# EAGLE board mcat-4cu-b-v2f (EAGLE 6.5.0)
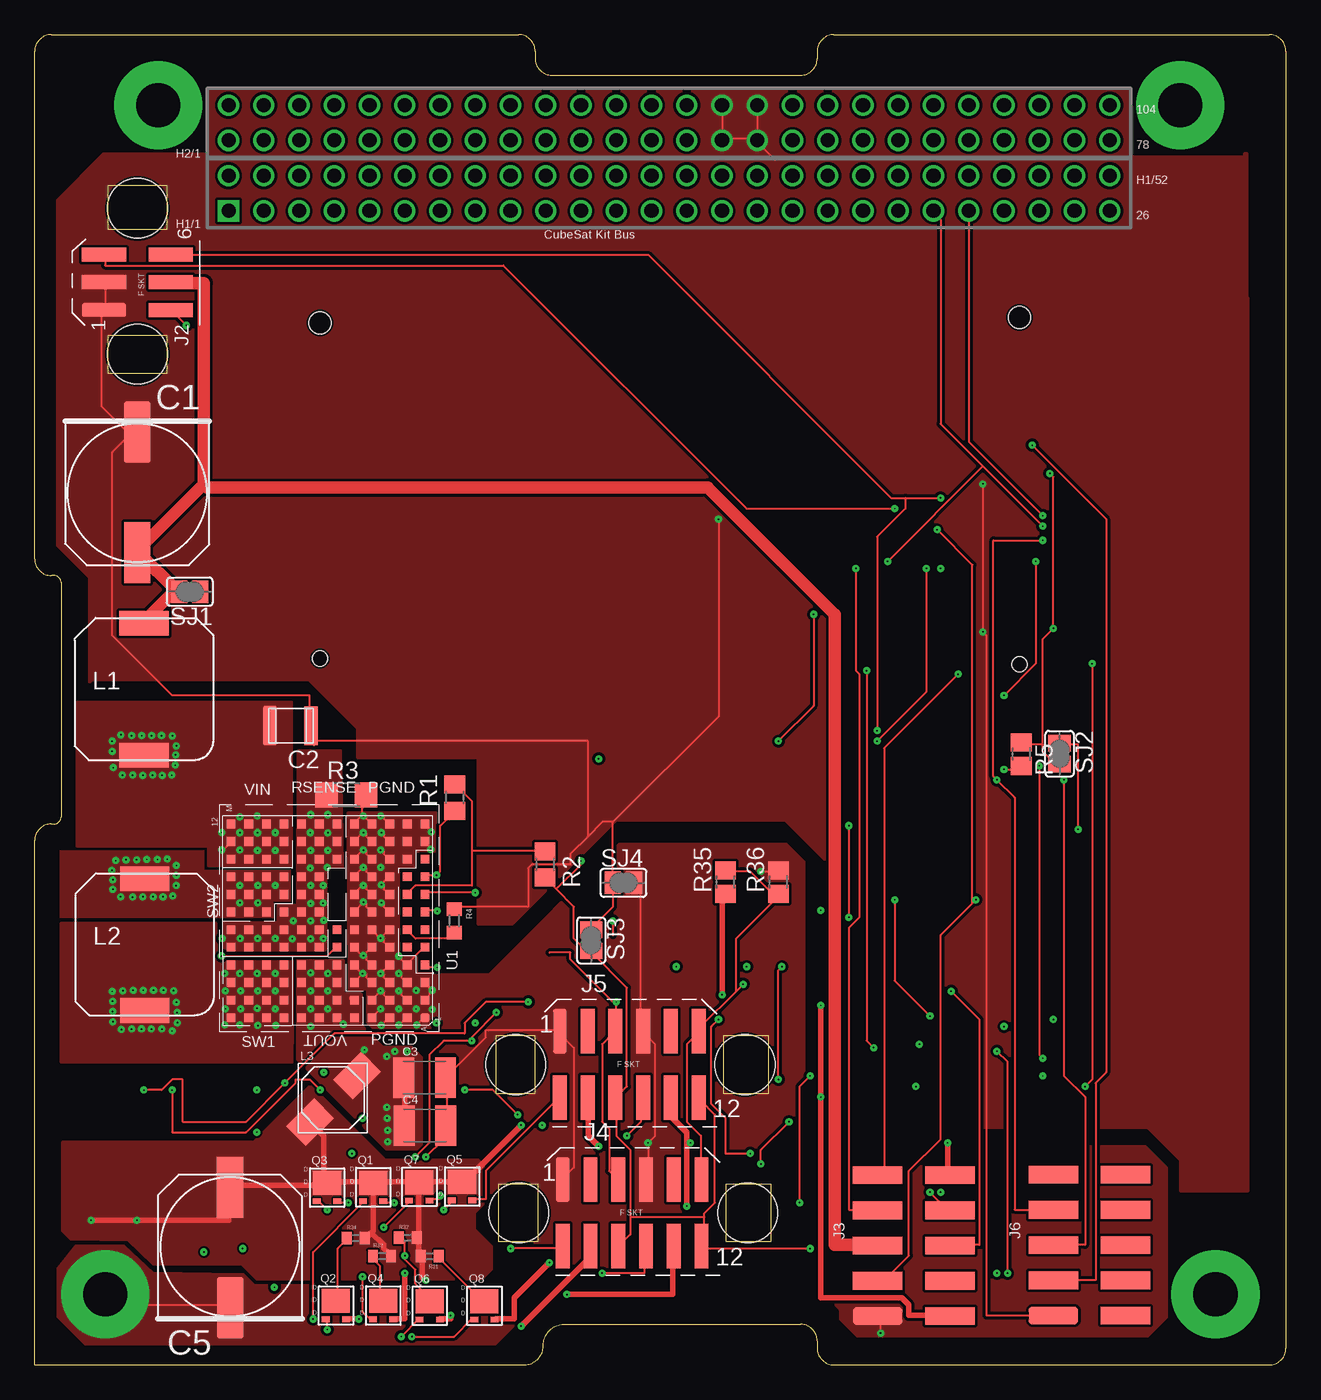
[diagram p5: board, top side]
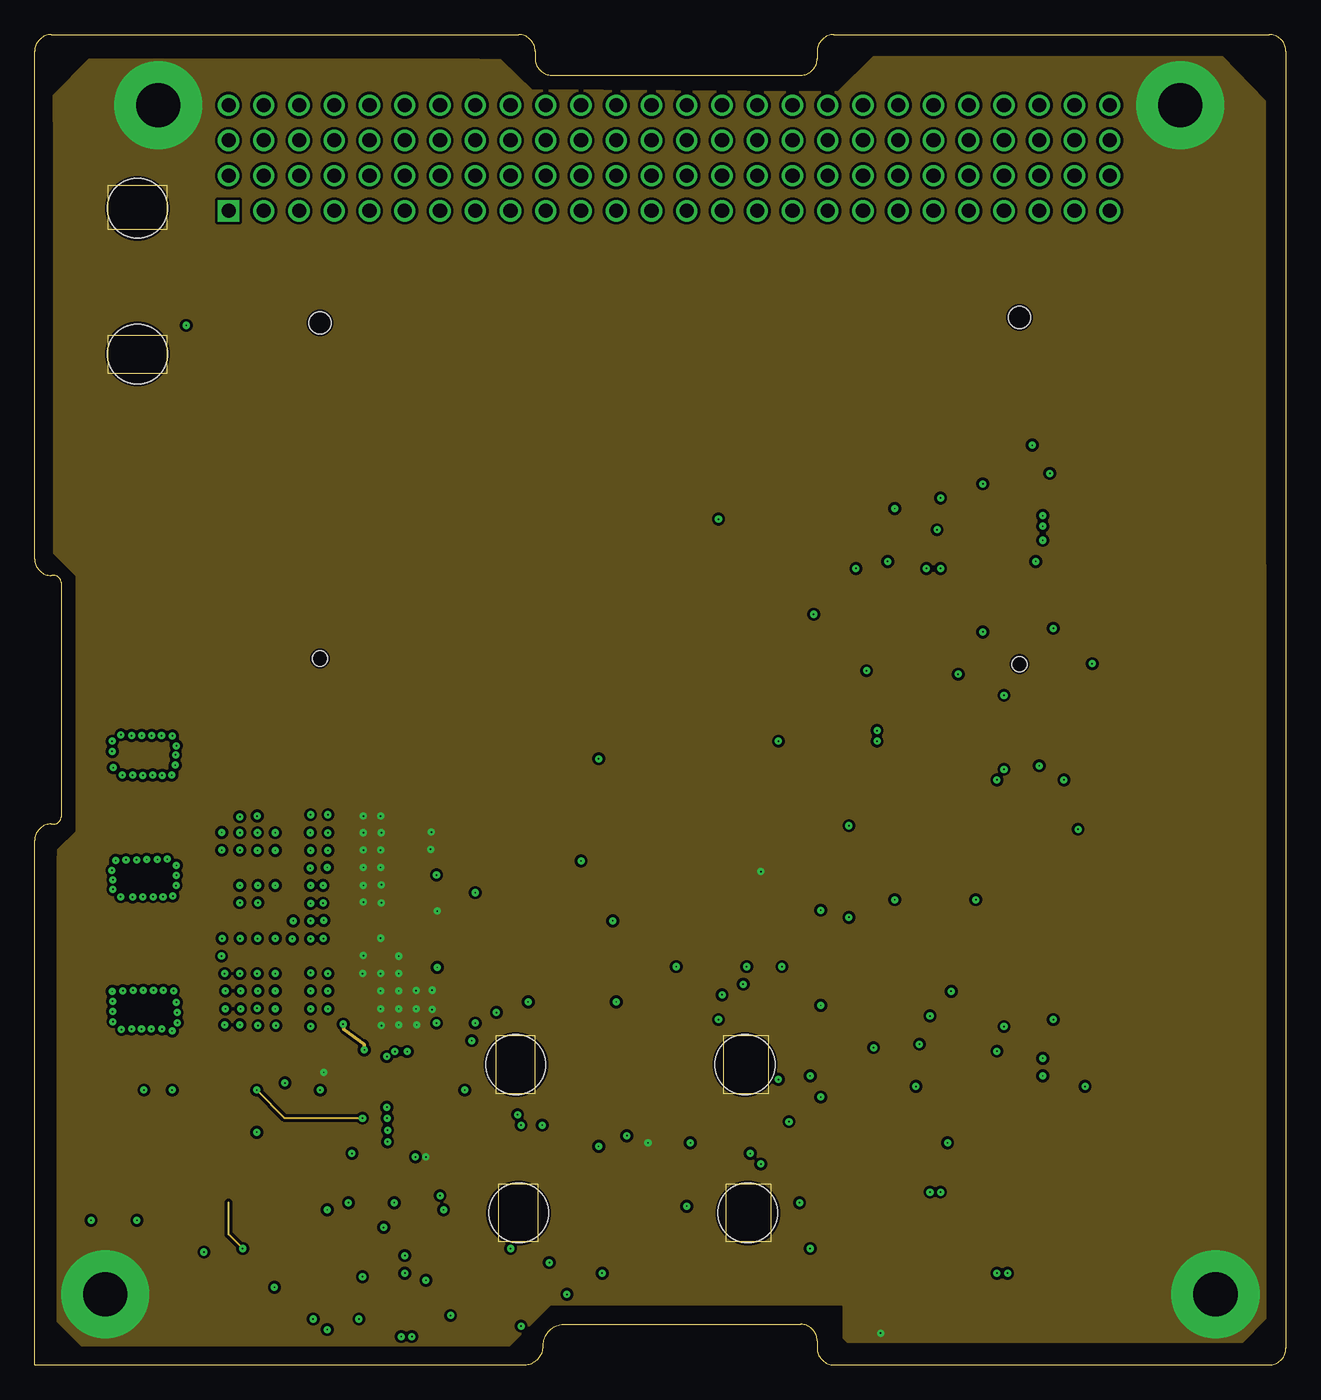
[diagram p6: board, inner layer GND_PLANE]
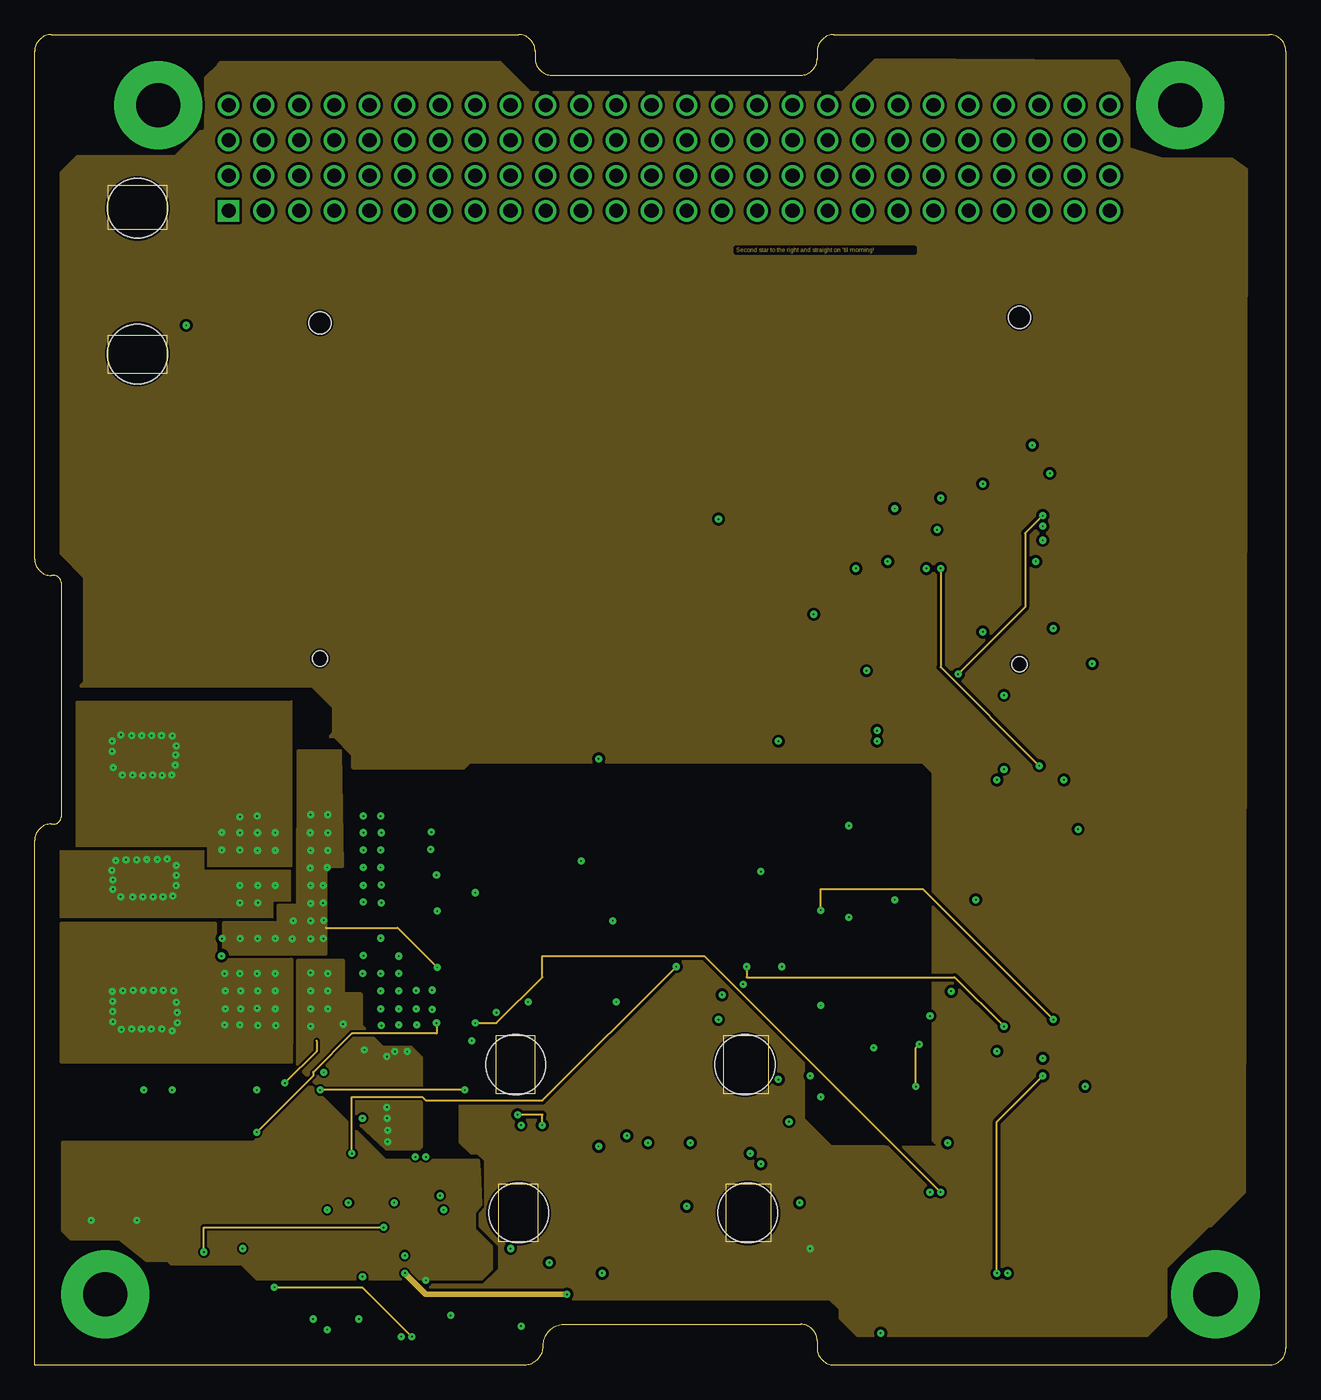
[diagram p7: board, inner layer GND_PLANE/TRACE]
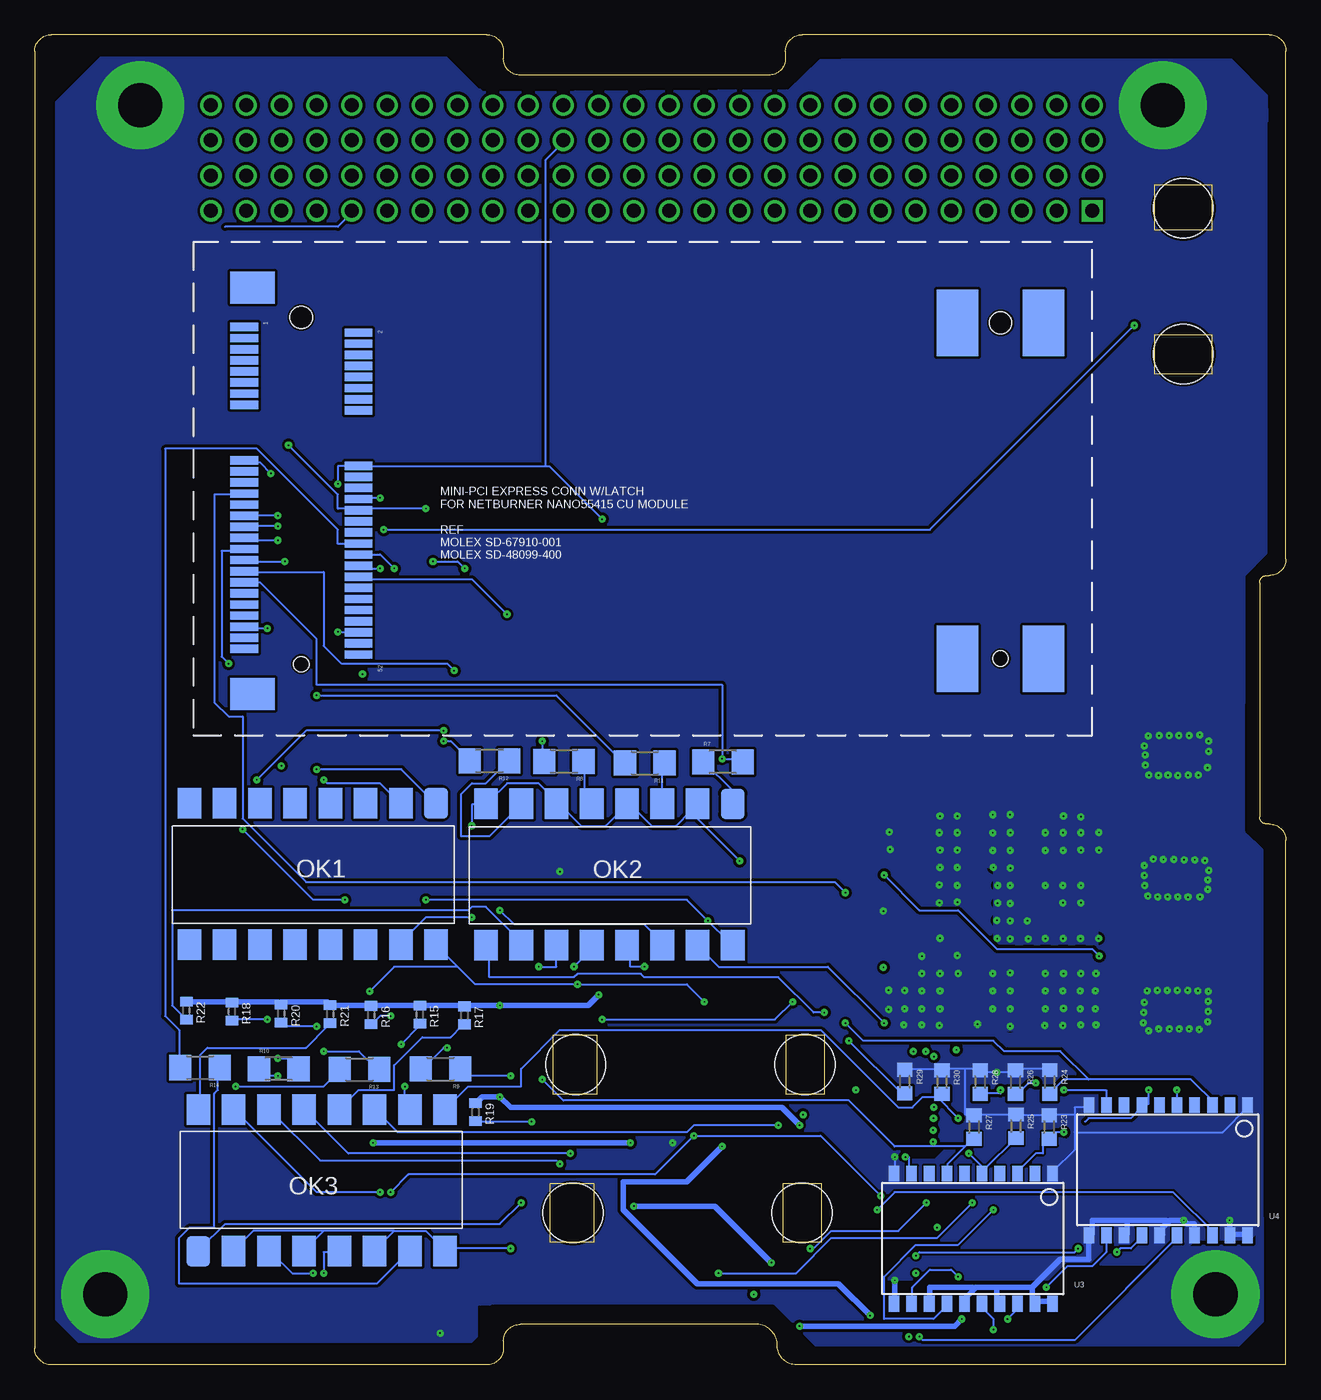
[diagram p8: board, bottom side, seen from below]

Size 90.17 x 95.89 mm. Coordinates in mm from the lower left corner, seen from the top.
Outline: 0,0 34.87,0 35.28,0 arc90 36.65,1.37 arc-90 38.12,2.92 55.19,2.92 arc-90 56.39,1.73 56.39,1.19 arc90 57.58,0 88.98,0 arc90 90.17,1.19 90.17,94.69 arc90 88.98,95.89 57.58,95.89 arc90 56.39,94.69 56.39,94.16 arc-90 55.19,92.96 37.26,92.96 arc-90 36.07,94.16 36.07,94.69 arc90 34.87,95.89 1.19,95.89 arc90 0,94.69 0,58.09 arc90 1.19,56.9 1.4,56.9 arc-90 1.91,56.39 1.91,39.5 arc-90 1.4,38.99 1.19,38.99 arc90 0,37.8 0,0
Copper layers (1+2*15+16): Top 0.035559375mm / dielectric 3.5mil / GND_PLANE 0.01778125mm / dielectric 47mil / GND_PLANE/TRACE 0.01778125mm / dielectric 3.5mil / Bottom 0.035559375mm
Design rules "mcat-4cu-b-v2f": minimum track width 6mil, minimum drill 4mil, track to track 6mil, track to pad 6mil, pad to pad 6mil, via to via 6mil, smd to smd 6mil, copper to edge 6.5mil, drill to drill 6.5mil, minimum pad ring 8mil, minimum via ring 8mil, stop-mask expansion 3mil, vias tented up to drill 0mil, thermal gap 10mil
Net classes: 0 default: clearance 0.205 mm; 1 vout1a2ozcu: width 0.406 mm; 2 vin2a2ozcu: width 0.889 mm
tRestrict: 27 lines
bRestrict: 31 lines

## Footprints (pad centres in the part's own frame; a part is rotated, then mirrored left to right if it is on the bottom)
OS-CON-SVPF-F12 = smd 1.9 x 4.4: A1 0,-4.3; K1 0,4.4
MLCC-X7R-1210 = smd 1 x 2.8: 1 1.6,0.05; 2 -1.35,0.05
C1210K = smd 1.5 x 2.9: 1 -1.5,0; 2 1.5,0
CSK-BUS-PKG = drill 1.016 pad 1.524 square: 1 -29.21,-3.81 | drill 1.016 pad 1.524: 2 -29.21,-1.27; 3 -26.67,-3.81; 4 -26.67,-1.27; 5 -24.13,-3.81; 6 -24.13,-1.27; 7 -21.59,-3.81; 8 -21.59,-1.27; 9 -19.05,-3.81; 10 -19.05,-1.27; 11 -16.51,-3.81; 12 -16.51,-1.27; 13 -13.97,-3.81; 14 -13.97,-1.27; 15 -11.43,-3.81; 16 -11.43,-1.27; 17 -8.89,-3.81; 18 -8.89,-1.27; 19 -6.35,-3.81; 20 -6.35,-1.27; 21 -3.81,-3.81; 22 -3.81,-1.27; 23 -1.27,-3.81; 24 -1.27,-1.27; 25 1.27,-3.81; 26 1.27,-1.27; 27 3.81,-3.81; 28 3.81,-1.27; 29 6.35,-3.81; 30 6.35,-1.27; 31 8.89,-3.81; 32 8.89,-1.27; 33 11.43,-3.81; 34 11.43,-1.27; 35 13.97,-3.81; 36 13.97,-1.27; 37 16.51,-3.81; 38 16.51,-1.27; 39 19.05,-3.81; 40 19.05,-1.27; 41 21.59,-3.81; 42 21.59,-1.27; 43 24.13,-3.81; 44 24.13,-1.27; 45 26.67,-3.81; 46 26.67,-1.27; 47 29.21,-3.81; 48 29.21,-1.27; 49 31.75,-3.81; 50 31.75,-1.27; 51 34.29,-3.81; 52 34.29,-1.27; 53 -29.21,1.27; 54 -29.21,3.81; 55 -26.67,1.27; 56 -26.67,3.81; 57 -24.13,1.27; 58 -24.13,3.81; 59 -21.59,1.27; 60 -21.59,3.81; 61 -19.05,1.27; 62 -19.05,3.81; 63 -16.51,1.27; 64 -16.51,3.81; 65 -13.97,1.27; 66 -13.97,3.81; 67 -11.43,1.27; 68 -11.43,3.81; 69 -8.89,1.27; 70 -8.89,3.81; 71 -6.35,1.27; 72 -6.35,3.81; 73 -3.81,1.27; 74 -3.81,3.81; 75 -1.27,1.27; 76 -1.27,3.81; 77 1.27,1.27; 78 1.27,3.81; 79 3.81,1.27; 80 3.81,3.81; 81 6.35,1.27; 82 6.35,3.81; 83 8.89,1.27; 84 8.89,3.81; 85 11.43,1.27; 86 11.43,3.81; 87 13.97,1.27; 88 13.97,3.81; 89 16.51,1.27; 90 16.51,3.81; 91 19.05,1.27; 92 19.05,3.81; 93 21.59,1.27; 94 21.59,3.81; 95 24.13,1.27; 96 24.13,3.81; 97 26.67,1.27; 98 26.67,3.81; 99 29.21,1.27; 100 29.21,3.81; 101 31.75,1.27; 102 31.75,3.81; 103 34.29,1.27; 104 34.29,3.81
M80-68106 = smd 1 x 3.2: 1 -2,2.4; 2 0,2.4; 3 2,2.4; 4 -2,-2.4; 5 0,-2.4; 6 2,-2.4 | hole 4.318: -5.175,0; 5.335,0
AMPMODU-SMT-PIN-HEADER-5X2 = smd 1.27 x 3.556: 1 -4.826,2.54; 2 -2.286,2.54; 3 0.254,2.54; 4 2.794,2.54; 5 5.334,2.54; 6 -4.826,-2.667; 7 -2.286,-2.667; 8 0.254,-2.667; 9 2.794,-2.667; 10 5.334,-2.667
M80-68112 = smd 1 x 3.2: 1 0,2.4; 2 2,2.4; 3 4,2.4; 4 6,2.4; 5 8,2.4; 6 10,2.4; 7 0,-2.4; 8 2,-2.4; 9 4,-2.4; 10 6,-2.4; 11 8,-2.4; 12 10,-2.4 | hole 4.318: -3.175,0; 13.335,0
MSS1048 = smd 3.56 x 1.78: 1 5,9.85; 2 5,0.35
SERIES-POWER-INDUCTORS = smd 2.85 x 2 rotated 45: 1 1.75,1.6; 2 -1.65,-1.75
PS2501L-4 = smd 2.2 x 1.7: 1 -1.6,19.03; 2 -1.6,16.49; 3 -1.6,13.95; 4 -1.6,11.41; 5 -1.6,8.87; 6 -1.6,6.33; 7 -1.6,3.79; 8 -1.6,1.25; 9 8.6,1.25; 10 8.6,3.79; 11 8.6,6.33; 12 8.6,8.87; 13 8.6,11.41; 14 8.6,13.95; 15 8.6,16.49; 16 8.6,19.03
1206-8-CHIPFET = smd 2.032 x 1.727: D 0,1.321 | smd 0.559 x 0.406: G -0.736,0; S 0.736,0
R0805 = smd 1.3 x 1.5: 1 -0.95,0; 2 0.95,0
R1206 = smd 1.6 x 1.803: 1 -1.422,0; 2 1.422,0
R0603 = smd 1 x 1.1: 1 -0.85,0; 2 0.85,0
R0805' = smd 1.3 x 1.5: 1 -0.85,0; 2 0.85,0
R0402 = smd 0.7 x 0.9: 1 -0.65,0; 2 0.65,0
SJ = smd 1.168 x 1.6: 1 -0.762,0; 2 0.762,0
LGA-141-LTC-05-08-1840-B = smd 0.63 x 0.63: A1 -7.116,-10.192; A2 -5.846,-10.192; A3 -4.576,-10.192; A4 -3.306,-10.192; A5 -2.036,-10.192; A6 -0.766,-10.192; A7 0.504,-10.192; A8 1.774,-10.192; A9 3.044,-10.192; A10 4.314,-10.192; A11 5.584,-10.192; A12 6.854,-10.192; B1 -7.116,-8.922; B2 -5.846,-8.922; B3 -4.576,-8.922; B4 -3.306,-8.922; B5 -2.036,-8.922; B6 -0.766,-8.922; B7 0.504,-8.922; B8 1.774,-8.922; B9 3.044,-8.922; B10 4.314,-8.922; B11 5.584,-8.922; B12 6.854,-8.922; C1 -7.116,-7.652; C2 -5.846,-7.652; C3 -4.576,-7.652; C4 -3.306,-7.652; C5 -2.036,-7.652; C6 -0.766,-7.652; C7 0.504,-7.652; C8 1.774,-7.652; C9 3.044,-7.652; C10 4.314,-7.652; C11 5.584,-7.652; C12 6.854,-7.652; D1 -7.116,-6.382; D2 -5.846,-6.382; D3 -4.576,-6.382; D4 -3.306,-6.382; D5 -2.036,-6.382; D6 -0.766,-6.382; D7 0.504,-6.382; D8 1.774,-6.382; D9 3.044,-6.382; D10 4.314,-6.382; D11 5.584,-6.382; D12 6.854,-6.382; E1 -7.116,-5.112; E2 -5.846,-5.112; E3 -4.576,-5.112; E4 -3.306,-5.112; E5 -2.036,-5.112; E6 -0.766,-5.112; E7 0.504,-5.112; E8 1.774,-5.112; E9 3.044,-5.112; E10 4.314,-5.112; E11 5.584,-5.112; E12 6.854,-5.112; F1 -7.116,-3.842; F2 -5.846,-3.842; F3 -4.576,-3.842; F4 -3.306,-3.842; F5 -2.036,-3.842; F6 -0.766,-3.842; F10 4.314,-3.842; F11 5.584,-3.842; F12 6.854,-3.842; G1 -7.116,-2.572; G2 -5.846,-2.572; G3 -4.576,-2.572; G4 -3.306,-2.572; G5 -2.036,-2.572; G6 -0.766,-2.572; G7 0.504,-2.572; G8 1.774,-2.572; G9 3.044,-2.572; G10 4.314,-2.572; G11 5.584,-2.572; G12 6.854,-2.572; H2 -5.846,-1.302; H3 -4.576,-1.302; H4 -3.306,-1.302; H5 -2.036,-1.302; H6 -0.766,-1.302; H7 0.504,-1.302; H8 1.774,-1.302; H9 3.044,-1.302; H10 4.314,-1.302; H11 5.584,-1.302; H12 6.854,-1.302; J5 -2.036,-0.032; J6 -0.766,-0.032; J7 0.504,-0.032; J8 1.774,-0.032; J9 3.044,-0.032; J10 4.314,-0.032; J11 5.584,-0.032; J12 6.854,-0.032; K5 -2.036,1.238; K6 -0.766,1.238; K7 0.504,1.238; K8 1.774,1.238; K9 3.044,1.238; K10 4.314,1.238; K11 5.584,1.238; K12 6.854,1.238; L5 -2.036,2.508; L6 -0.766,2.508; L7 0.504,2.508; L8 1.774,2.508; L9 3.044,2.508; L10 4.314,2.508; L11 5.584,2.508; L12 6.854,2.508; M5 -2.036,3.778; M6 -0.766,3.778; M7 0.504,3.778; M8 1.774,3.778; M9 3.044,3.778; M10 4.314,3.778; M11 5.584,3.778; M12 6.854,3.778; SW1@J1 -7.116,-0.032; SW1@J2 -5.846,-0.032; SW1@J3 -4.576,-0.032; SW1@J4 -3.306,-0.032; SW1@K1 -7.116,1.238; SW1@K2 -5.846,1.238; SW1@K3 -4.576,1.238; SW1@K4 -3.306,1.238; SW1@L1 -7.116,2.508; SW1@L2 -5.846,2.508; SW1@L3 -4.576,2.508; SW1@L4 -3.306,2.508; SW1@M1 -7.116,3.778; SW1@M2 -5.846,3.778; SW1@M3 -4.576,3.778; SW1@M4 -3.306,3.778; VOUT -7.116,-1.302
MOLEX-MINI-PCI-EXPRESS-8MM-52CKT = smd 0.6 x 2: 1 -11.65,-26.8; 2 -11.248,-18.576; 3 -10.85,-26.8; 4 -10.447,-18.576; 5 -10.05,-26.8; 6 -9.648,-18.576; 7 -9.25,-26.8; 8 -8.848,-18.576; 9 -8.45,-26.8; 10 -8.047,-18.576; 11 -7.65,-26.8; 12 -7.247,-18.576; 13 -6.85,-26.8; 14 -6.447,-18.576; 15 -6.05,-26.8; 16 -5.647,-18.576; 17 -2.05,-26.8; 18 -1.647,-18.576; 19 -1.25,-26.8; 20 -0.848,-18.576; 21 -0.45,-26.8; 22 -0.048,-18.576; 23 0.35,-26.8; 24 0.752,-18.576; 25 1.15,-26.8; 26 1.552,-18.576; 27 1.95,-26.8; 28 2.353,-18.576; 29 2.75,-26.8; 30 3.152,-18.576; 31 3.55,-26.8; 32 3.953,-18.576; 33 4.35,-26.8; 34 4.753,-18.576; 35 5.15,-26.8; 36 5.553,-18.576; 37 5.95,-26.8; 38 6.353,-18.576; 39 6.75,-26.8; 40 7.152,-18.576; 41 7.55,-26.8; 42 7.952,-18.576; 43 8.35,-26.8; 44 8.752,-18.576; 45 9.15,-26.8; 46 9.553,-18.576; 47 9.95,-26.8; 48 10.352,-18.576; 49 10.75,-26.8; 50 11.152,-18.576; 51 11.55,-26.8; 52 11.953,-18.576 | smd 2.3 x 3.2: P$1 -14.5,-26.2; P$2 14.8,-26.2 | smd 4.8 x 3: P$3 12.25,24.6; P$4 -11.95,24.6; P$5 -11.95,30.8; P$6 12.25,30.8 | hole 1.6: -12.35,-22.7; -11.95,27.7 | hole 1.1: 12.65,-22.7; 12.25,27.7
20-LEAD-PLASTIC-SO = smd 0.762 x 1.143: 1 0,0; 2 1.27,0; 3 2.54,0; 4 3.81,0; 5 5.08,0; 6 6.35,0; 7 7.62,0; 8 8.89,0; 9 10.16,0; 10 11.43,0; 11 11.43,9.398; 12 10.16,9.398; 13 8.89,9.398; 14 7.62,9.398; 15 6.35,9.398; 16 5.08,9.398; 17 3.81,9.398; 18 2.54,9.398; 19 1.27,9.398; 20 0,9.398

## Placement (x,y rotation side)
C1  68uF  [OS-CON-SVPF-F12]  7.39,62.84 0 top
C2  4.7uF  [MLCC-X7R-1210]  18.56,46.12 180 top
C3  10uF  [C1210K]  28.1,20.7 0 top
C4  10uF  [C1210K]  28.13,17.24 0 top
C5  68uF  [OS-CON-SVPF-F12]  14.08,8.51 180 top
J1  2 x ESQ-126-39-G-D  [CSK-BUS-PKG]  43.18,87 0 top
J2  M80-6810642  [M80-68106]  7.4,78.04 90 top
J3  AMPMODU 5X2 SMT HDR  [AMPMODU-SMT-PIN-HEADER-5X2]  63.28,8.34 90 top
J4  M80-6811242  [M80-68112]  38.05,10.96 0 top
J5  M80-6811242  [M80-68112]  37.85,21.65 0 top
J6  AMPMODU 5X2 SMT HDR  [AMPMODU-SMT-PIN-HEADER-5X2]  75.95,8.38 90 top
L1  33 uH  [MSS1048]  2.89,43.6 0 top
L2  330 uH  [MSS1048]  2.93,25.2 0 top
L3  10 uH  [SERIES-POWER-INDUCTORS]  21.48,19.23 0 top
OK1  PS2501L-4  [PS2501L-4]  80.28,38.88 270 bottom
OK2  PS2501L-4  [PS2501L-4]  58.9,38.84 270 bottom
OK3  PS2501L-4  [PS2501L-4]  59.34,9.79 90 bottom
Q1  SI5404BDC  [1206-8-CHIPFET]  24.39,11.81 0 top
Q2  SI5404BDC  [1206-8-CHIPFET]  21.7,3.29 0 top
Q3  SI5404BDC  [1206-8-CHIPFET]  21.06,11.79 0 top
Q4  SI5404BDC  [1206-8-CHIPFET]  25.11,3.28 0 top
Q5  SI5404BDC  [1206-8-CHIPFET]  30.79,11.86 0 top
Q6  SI5404BDC  [1206-8-CHIPFET]  28.46,3.26 0 top
Q7  SI5404BDC  [1206-8-CHIPFET]  27.72,11.84 0 top
Q8  SI5404BDC  [1206-8-CHIPFET]  32.4,3.26 0 top
R1  3K79  [R0805]  30.28,40.89 90 top
R2  1K  [R0805]  36.78,36.07 270 top
R3  70 mOhms  [R1206]  22.46,41.08 0 top
R4  4k7 0.1%  [R0603]  30.24,32 270 top
R5  1K  [R0805']  71.09,44.03 270 top
R7  5K42  [R1206]  40.58,43.47 0 bottom
R8  5K42  [R1206]  52.04,43.51 180 bottom
R9  5K42  [R1206]  60.94,21.32 180 bottom
R10  5K42  [R1206]  72.59,21.34 0 bottom
R11  5K42  [R1206]  46.21,43.37 180 bottom
R12  5K42  [R1206]  57.4,43.53 180 bottom
R13  5K42 0.1%  [R1206]  66.77,21.3 180 bottom
R14  5K42 0.1%  [R1206]  78.26,21.42 180 bottom
R15  R-US_R0402  [R0402]  62.42,25.24 270 bottom
R16  100K 0.1%  [R0402]  65.92,25.22 270 bottom
R17  100K 0.1%  [R0402]  59.2,25.19 270 bottom
R18  100K 0.1%  [R0402]  75.96,25.46 270 bottom
R19  100K 0.1%  [R0402]  58.41,18.22 270 bottom
R20  100K 0.1%  [R0402]  72.41,25.31 270 bottom
R21  100K 0.1%  [R0402]  68.87,25.28 270 bottom
R22  100K 0.1%  [R0402]  79.24,25.53 270 bottom
R23  51K 0.1%  [R0603]  17.07,17.14 270 bottom
R24  51K 0.1%  [R0603]  17.03,20.39 270 bottom
R25  51K 0.1%  [R0603]  19.46,17.19 270 bottom
R26  51K 0.1%  [R0603]  19.5,20.37 270 bottom
R27  51K 0.1%  [R0603]  22.48,17.13 270 bottom
R28  51K 0.1%  [R0603]  22.04,20.37 270 bottom
R29  51k 0.1%  [R0603]  27.47,20.41 270 bottom
R30  51k 0.1%  [R0603]  24.79,20.37 270 bottom
R31  0.1R  [R0402]  28.47,7.83 180 top
R32  0.1R  [R0402]  26.88,9.16 0 top
R33  0.1R  [R0402]  25.03,7.83 0 top
R34  0.1R  [R0402]  23.13,9.13 0 top
R35  180R  [R0805']  49.78,34.8 90 top
R36  1K  [R0805']  53.59,34.8 90 top
SJ1  0R  [SJ]  11.17,55.73 180 top
SJ2  0R  [SJ]  73.85,44.05 270 top
SJ3  0R  [SJ]  40.1,30.6 270 top
SJ4  0R  [SJ]  42.42,34.75 0 top
U1  LTM4609MPV#PBF  [LGA-141-LTC-05-08-1840-B]  17.93,32.14 90 top
U2  UCAT-4CU-B-CONTROL-UNITNANO55415  [MOLEX-MINI-PCI-EXPRESS-8MM-52CKT]  48.26,63.16 270 bottom
U3  LT1161ISW  [20-LEAD-PLASTIC-SO]  16.82,13.79 180 bottom
U4  LT1161ISW  [20-LEAD-PLASTIC-SO]  2.77,18.73 180 bottom

## Tracks (layer width: path | path; a pad name or v marks a point on that pad's centre or on a via)
CH1_P18H  (via drill 0.1)
  Top 0.406: v23.37,3.3 22.61,3.3 Q2.S | v35.05,2.79 39.88,7.62 39.88,8.38 J4.8
  Bottom 0.406: v23.37,3.3 23.88,2.79 v35.05,2.79
CH1_P18L  (via drill 0.1)
  Top 0.152: v25.91,11.68 25.15,11.68 Q1.S | v34.29,8.38 37.85,8.38 J4.7
  Bottom 0.152: v25.91,11.68 27.94,9.65 32.77,9.65 34.04,8.38 v34.29,8.38
CH1HG  (via drill 0.1)
  Top 0.152: v21.08,2.54 21.08,3.3 Q2.G
  Bottom 0.152: v21.08,2.54 21.08,3.3 22.1,4.32 U3.16
CH1LG  (via drill 0.1)
  Top 0.152: v20.07,3.3 20.07,8.13 23.62,11.68 Q1.G
  Bottom 0.152: v20.07,3.3 19.56,3.81 19.56,4.32 U3.18
CH1S
  Top 0.152: R34.1 22.35,8.89 21.84,8.38 21.84,4.83 Q2.D
CH2_P18H  (via drill 0.1)
  Top 0.406: v26.67,6.6 26.67,3.3 25.91,3.3 Q4.S | v38.35,5.08 45.97,5.08 45.97,8.38 J4.11
  GND_PLANE/TRACE 0.406: v26.67,6.6 28.19,5.08 v38.35,5.08
CH2_P18L  (via drill 0.1)
  Top 0.152: v22.61,11.68 21.84,11.68 Q3.S | v40.89,6.6 43.94,6.6 43.94,8.38 J4.10
  Bottom 0.152: v22.61,11.68 25.15,9.14 32.77,9.14 35.31,6.6 v40.89,6.6
CH2HG  (via drill 0.1)
  Top 0.152: v23.62,6.35 23.62,3.81 24.13,3.3 Q4.G
  Bottom 0.152: v23.62,6.35 24.13,6.86 25.65,6.86 26.92,5.59 26.92,4.57 U3.12
CH2LG  (via drill 0.1)
  Top 0.152: v21.08,11.18 20.57,11.68 Q3.G
  Bottom 0.152: v21.08,11.18 23.62,8.64 26.67,8.64 28.96,6.35 28.96,3.3 25.4,3.3 24.38,4.32 U3.14
CH2S
  Top 0.152: R33.1 24.38,7.62 24.89,7.11 24.89,4.83 Q4.D
CH3_P18H  (via drill 0.1)
  Top 0.406: v29.97,3.56 29.97,3.3 29.21,3.3 Q6.S | v40.64,15.75 39.88,16.51 39.88,19.05 J5.8
  Bottom 0.406: v29.97,3.56 32.26,5.84 42.42,5.84 47.75,11.18 47.75,13.21 43.18,13.21 v40.64,15.75
CH3_P18L
  Top 0.152: Q5.S 31.75,11.94 32.51,11.94 32.51,13.97 37.59,19.05 J5.7
CH3HG  (via drill 0.1)
  Top 0.152: v26.42,2.03 27.69,3.3 Q6.G
  Bottom 0.152: v26.42,2.03 26.16,1.78 15.24,1.78 7.87,9.14 U4.16
CH3LG  (via drill 0.1)
  Top 0.152: v29.46,11.18 29.97,11.68 Q5.G
  Bottom 0.152: v29.46,11.18 28.19,12.45 8.13,12.45 5.08,9.4 U4.18
CH3S  (via drill 0.1)
  Top 0.152: R32.1 26.42,9.14 26.67,8.89 v26.67,7.87 26.67,7.62 27.43,6.86 27.43,5.84 28.45,4.83 Q6.D
  GND_PLANE 0.152: 13.97,11.68 13.97,9.4 v14.99,8.38
  Bottom 0.152: v14.99,8.38 15.24,8.13 26.42,8.13 v26.67,7.87
CH4_P18H  (via drill 0.1)
  Top 0.406: v37.08,7.37 34.54,4.83 34.54,3.3 33.27,3.3 Q8.S | 46.99,16 46.99,16.76 45.97,17.78 45.97,19.05 J5.11 | 46.99,16 v46.99,11.43 | v65.79,16 65.79,13.72 J3.10 | 46.99,16 v47.24,16
  Bottom 0.406: v37.08,7.37 41.15,11.43 v46.99,11.43 | v47.24,16 v65.79,16
CH4_P18L  (via drill 0.1)
  Top 0.152: v29.21,12.19 29.21,11.94 28.7,11.94 Q7.S | v42.67,16.51 43.69,17.53 43.69,19.05 J5.10 | v64.52,12.45 65.79,11.18 J3.9
  Bottom 0.152: v29.21,12.19 33.53,16.51 v42.67,16.51 45.47,13.72 63.25,13.72 v64.52,12.45
CH4HG  (via drill 0.1)
  Top 0.152: v27.18,2.03 30.23,2.03 31.5,3.3 Q8.G
  GND_PLANE/TRACE 0.152: v27.18,2.03 23.62,5.59 v17.27,5.59
  Bottom 0.152: v17.27,5.59 15.75,7.11 13.97,7.11 12.95,8.13 12.95,9.14 U4.12
CH4LG  (via drill 0.1)
  Top 0.152: v25.15,9.91 26.92,11.68 Q7.G
  GND_PLANE/TRACE 0.152: v25.15,9.91 12.19,9.91 v12.19,8.13
  Bottom 0.152: v12.19,8.13 11.94,8.38 11.18,8.38 10.41,9.14 U4.14
CH4S
  Top 0.152: R31.1 29.21,7.62 32.26,4.57 Q8.D
GND  (via drill 0.1)
  Top 0.152: J1.82 49.53,88.39 | J1.84 52.07,88.39 | 52.07,88.39 49.53,88.39 | 49.53,88.39 J1.81 | 52.07,88.39 J1.83 52.07,88.14 53.34,86.87 | J2.2 5.08,77.98 5.08,76.2 J2.1 4.83,75.95 4.83,69.09 6.86,67.06 | 39.88,31.5 SJ3.1 40.13,31.5 41.66,33.02 41.66,34.54 SJ4.1 41.66,34.8 41.66,39.12 | 20.12,44.65 C2.2 | 6.86,67.06 5.59,65.79 5.59,52.58 9.91,48.26 19.81,48.26 19.81,46.74 19.86,46.69 19.86,44.91 C2.2 | 6.86,67.06 C1.K1 | v68.33,63.5 v68.33,52.83 68.58,52.58 68.58,3.56 J6.1 | 39.88,38.1 40.89,39.12 41.66,39.12 | 39.88,38.1 38.61,36.83 38.61,36.07 35.81,36.07 35.56,35.81 35.56,33.02 30.48,33.02 R4.1 | 41.66,39.12 49.28,46.74 v49.28,60.96 | 39.88,38.1 39.88,44.96 20.07,44.96 C2.2
  Bottom 0.152: v68.33,52.83 67.06,52.83 U2.48 | v68.33,63.5 68.33,64.77 67.06,64.77 U2.18 66.8,64.77 53.34,64.77 | v49.28,60.96 53.09,64.77 53.34,64.77 | 53.34,64.77 53.34,86.87 52.07,88.14 J1.83
  pour Top (no thermals): 12.5,92.02 78.99,92.02 78.99,90.73 79.02,90.73 79.02,87.05 87.2,87.05 87.2,87.3 87.33,87.3 87.33,76.89 87.4,76.89 87.4,12.55 82.58,12.55 82.58,14.48 82.58,14.76 80.21,17.12 61.24,17.12 59.54,18.82 59.54,33.83 54.1,39.27 41.91,39.27 34.42,31.78 31.95,31.78 31.95,43.76 23.29,43.76 23.29,44.04 23.29,45.87 19.76,49.4 4.14,49.4 3.96,49.23 3.96,56.74 1.65,59.05 1.65,83.97 4.95,87.27 12.62,87.27 12.62,91.87
I2C(CLK)  (via drill 0.1)
  Top 0.152: v72.64,61.21 67.31,66.55 J1.43 | v66.55,49.78 61.21,44.45 61.21,13.97 60.96,13.72 J3.5
  GND_PLANE/TRACE 0.152: v66.55,49.78 71.37,54.61 71.37,59.94 v72.64,61.21
  Bottom 0.152: 76.45,82.04 68.33,82.04 67.31,83.06 J1.43 | v72.64,61.21 74.93,61.21 U2.27
I2C(DATA)  (via drill 0.1)
  Top 0.152: J1.41 64.77,83.06 65.28,82.55 65.28,67.82 68.33,64.77 | 68.33,64.77 v72.64,60.45 | v59.18,57.4 59.18,50.04 59.44,49.78 59.44,32.26 58.67,31.5 58.67,11.18 60.71,11.18 J3.4 | 68.33,64.77 v61.47,57.91
  Bottom 0.152: v72.64,60.45 74.93,60.45 U2.29 | v59.18,57.4 59.69,57.91 v61.47,57.91
INTVCC  (via drill 0.1)
  Top 0.152: v13.46,29.46 21.08,29.46 21.59,29.97 U1.F5 | U1.A9 28.19,35.31 v28.96,35.31 29.21,35.56 29.21,38.86 30.23,39.88 R1.1
  Bottom 0.152: v13.46,29.46 13.97,29.97 20.83,29.97 23.62,32.77 26.42,32.77 v28.96,35.31
N$4  (via drill 0.1)
  Top 0.152: v41.66,32 41.66,30.99 | v64.52,25.15 61.98,27.69 v61.98,33.53
  Bottom 0.152: OK2.16 39.88,30.48 40.13,30.48 v41.66,32 43.18,33.53 v61.98,33.53 | v64.52,25.15 65.28,25.15 65.79,24.64 R16.2
N$5  (via drill 0.1)
  GND_PLANE/TRACE 0.152: v73.41,24.89 64.01,34.29 56.64,34.29 v56.64,32.77
  Bottom 0.152: v73.41,24.89 75.95,24.89 R18.2 | v56.64,32.77 55.63,31.75 46.23,31.75 44.96,30.48 OK2.14
N$7  (via drill 0.1)
  GND_PLANE/TRACE 0.152: v69.85,24.38 66.29,27.94 51.31,27.94 v51.31,28.7
  Bottom 0.152: v69.85,24.38 72.14,24.38 72.39,24.64 R20.2 | v51.31,28.7 49.78,30.23 OK2.12
N$9
  Bottom 0.152: R22.2 79.25,24.89 80.26,25.91 80.26,32.77 58.93,32.77 58.67,33.02 57.66,33.02 55.12,30.48 OK2.10
N$10
  Bottom 0.152: R21.2 69.09,24.38 70.61,22.86 77.72,22.86 78.23,22.35 78.23,18.54 OK3.16
N$11  (via drill 0.1)
  Top 0.152: v54.36,17.53 52.32,15.49 v52.32,14.48
  Bottom 0.152: v54.36,17.53 58.17,17.53 R19.2 | v52.32,14.48 52.58,14.73 69.6,14.73 73.15,18.29 OK3.14
N$12
  Bottom 0.152: R17.2 59.44,24.38 60.2,23.62 62.23,23.62 64.26,21.59 64.26,19.81 66.8,19.81 68.07,18.54 OK3.12
N$13  (via drill 0.1)
  GND_PLANE/TRACE 0.152: v63.75,23.11 63.5,22.86 v63.5,20.07
  Bottom 0.152: v63.75,23.11 62.48,24.38 R15.2 | v63.5,20.07 63.5,18.54 63.25,18.54 OK3.10
N$16  (via drill 0.1)
  Top 0.152: v69.85,42.93 70.87,42.93 R5.2
  Bottom 0.152: v69.85,42.93 63.75,42.93 61.47,40.64 OK1.1
OK1E1  (via drill 0.1)
  GND_PLANE/TRACE 0.152: v16,16.76 20.07,20.83 20.07,21.08 22.86,23.88 28.96,23.88 v28.96,24.64
  Bottom 0.152: U3.3 19.3,13.97 18.03,15.24 17.53,15.24 17.53,16.26 17.27,16.26 R23.2 17.02,16.51 16.76,16.76 v16,16.76 | OK2.15 42.42,30.23 40.89,28.7 33.02,28.7 v28.96,24.64
OK1E2  (via drill 0.1)
  GND_PLANE/TRACE 0.152: v46.23,28.7 36.58,19.05 28.19,19.05 27.94,19.3 22.86,19.3 v22.86,15.24
  Bottom 0.152: 21.59,14.22 21.84,13.97 U3.5 21.59,14.22 | 21.59,14.22 19.56,16.26 R25.2 | v46.23,28.7 47.24,28.7 47.24,30.23 OK2.13 | v22.86,15.24 21.84,14.22 21.59,14.22
OK1E3  (via drill 0.1)
  Top 0.152: v53.85,28.7 53.59,28.45 v53.59,20.57
  Bottom 0.152: 23.11,15.75 24.38,14.48 24.38,13.97 U3.7 | 23.11,15.75 22.61,16.26 R27.2 | v53.85,28.7 52.58,28.7 52.58,30.23 OK2.11 | v53.59,20.57 52.07,19.05 31.5,19.05 28.19,15.75 23.11,15.75
OK1E4  (via drill 0.1)
  Top 0.152: v33.27,25.4 31.5,23.62 v31.5,23.37 29.46,23.37 28.45,22.35 28.45,16 v27.43,14.99
  Bottom 0.152: v31.5,23.37 27.69,19.56 R29.2 | v27.43,14.99 27.18,14.99 27.18,13.97 U3.9 | v33.27,25.4 34.04,25.4 36.58,27.94 46.23,27.94 46.48,28.19 51.05,28.19 51.31,27.94 57.4,27.94 57.4,30.23 OK2.9
OK2E1  (via drill 0.1)
  GND_PLANE/TRACE 0.152: v65.28,12.45 48.26,29.46 36.58,29.46 36.58,27.94 33.27,24.64 v31.75,24.64
  Bottom 0.152: 14.22,20.57 6.86,20.57 5.08,18.8 U4.3 | 14.22,20.57 16,20.57 17.02,19.56 R24.2 | v65.28,12.45 69.85,12.45 75.69,18.29 OK3.15 | v31.75,24.64 30.48,23.37 21.08,23.37 20.32,22.61 16.26,22.61 14.22,20.57
OK2E2  (via drill 0.1)
  Top 0.152: v49.28,24.89 48.77,24.38 48.77,18.8 49.78,17.78 49.78,15.24 v51.56,15.24 | v7.87,19.81 9.14,19.81 9.91,20.57 10.67,20.57 10.67,17.53 15.24,17.53 v18.03,20.32 21.59,23.88 30.99,23.88 30.99,24.64 32.51,26.16 v35.56,26.16
  GND_PLANE/TRACE 0.152: v18.03,20.32 20.32,22.61 20.32,23.37
  Bottom 0.152: v18.03,20.32 18.54,20.32 19.3,19.56 R26.2 | v7.87,19.81 7.87,18.8 U4.5 | v51.56,15.24 67.56,15.24 70.61,18.29 OK3.13 | v35.56,26.16 36.83,24.89 v49.28,24.89
OK2E3  (via drill 0.1)
  Top 0.152: v20.57,19.81 19.81,20.57 18.8,20.57 18.8,20.32 15.24,16.76 9.91,16.76 v9.91,19.81 | v30.99,19.81 33.02,19.81 v34.8,18.03
  GND_PLANE/TRACE 0.152: v30.99,19.81 v20.57,19.81 | v34.8,18.03 36.58,18.03 v36.58,17.27
  Bottom 0.152: 14.48,17.53 14.22,17.78 11.18,17.78 10.41,18.54 U4.7 10.16,18.8 9.91,18.8 v9.91,19.81 | R28.2 21.84,19.56 20.57,19.56 v20.57,19.81 | v36.58,17.27 42.67,17.27 43.18,16.76 64.01,16.76 65.53,18.29 OK3.11
OK2E4  (via drill 0.1)
  GND_PLANE 0.152: v16,19.81 18.03,17.78 v23.62,17.78
  Bottom 0.152: 25.15,19.3 26.16,19.3 26.92,18.54 27.94,18.54 33.53,24.13 52.32,24.13 55.12,21.34 55.12,20.07 58.93,20.07 60.45,18.54 OK3.9 | 25.15,19.3 24.89,19.3 R30.2 25.15,19.3 | v16,19.81 12.95,19.81 12.95,18.8 U4.9 | 25.15,19.3 v23.62,17.78
P3  (via drill 0.1)
  Top 0.152: 72.64,44.7 71.12,44.7 R5.1 | 72.64,44.7 72.64,44.2 73.66,43.18 SJ2.2 | 72.64,44.7 72.64,52.32 v73.41,53.09 73.41,64.01 v73.15,64.26
  Bottom 0.152: v73.41,53.09 74.93,53.09 U2.47 | v73.15,64.26 73.91,65.02 74.93,65.02 U2.17
P3_SW  (via drill 0.1)
  Top 0.152: v75.18,38.61 75.18,44.7 73.91,44.7 SJ2.1 | 67.56,33.27 65.28,30.99 65.28,16.26 62.99,13.97 62.99,7.87 60.96,5.84 J3.2 | 67.56,33.27 v67.82,33.53 | v10.92,74.93 9.91,75.95 J2.4 | v65.02,60.2 67.56,57.66 67.56,33.27
  Bottom 0.152: v75.18,38.61 70.1,33.53 v67.82,33.53 | v10.92,74.93 25.65,60.2 v65.02,60.2
P18_SW1
  Bottom 0.152: 39.88,41.4 39.88,40.64 OK2.1 39.88,41.4 | 39.88,41.4 41.91,43.43 R7.1
P18_SW2
  Bottom 0.152: R8.1 50.55,43.43 50.55,40.64 50.04,40.64 OK2.5
P18_SW3  (via drill 0.1)
  Top 0.152: v55.88,20.83 55.12,20.07 v55.12,11.68
  Bottom 0.152: v55.88,20.83 59.18,20.83 59.44,21.08 R9.1 | v55.12,11.68 56.64,10.16 76.45,10.16 78.23,8.38 OK3.1
P18_SW4  (via drill 0.1)
  GND_PLANE/TRACE 0.152: v72.64,20.83 69.34,17.53 v69.34,6.6
  Bottom 0.152: v72.64,20.83 73.41,20.83 73.91,21.34 R10.1 | v69.34,6.6 69.34,8.13 68.33,8.13 OK3.5
P18_SW5
  Bottom 0.152: R11.1 44.96,43.18 44.96,40.64 OK2.3
P18_SW6
  Bottom 0.152: R12.1 56.13,43.43 57.66,41.91 58.67,41.91 59.44,41.15 59.44,38.1 57.4,38.1 55.12,40.39 OK2.7
P18_SW7  (via drill 0.1)
  Top 0.152: v69.34,22.61 70.1,21.84 v70.1,6.6
  Bottom 0.152: v69.34,22.61 66.8,22.61 65.53,21.34 R13.1 | v70.1,6.6 71.63,6.6 73.15,8.13 OK3.3
P18_SW8
  Bottom 0.152: R14.1 76.96,21.34 76.96,19.81 77.22,19.56 77.22,9.91 78.99,9.91 79.76,9.14 79.76,5.84 65.53,5.84 63.25,8.13 OK3.7
PGND  (via drill 0.1, 0.1 pad 0.25, 3.17 pad 6.35)
  Top 0.152: 26.85,36.4 26.86,36.4 | 26.85,38.94 26.86,38.94 | 26.85,37.8 U1.B11 | 28.25,38.94 U1.A12 | 27.86,37.67 28.12,37.67 U1.A11 28.19,37.59 28.45,37.34 v28.53,37.16 | 27.86,38.94 28.12,38.94 U1.A12 | 24.43,24.97 U1.D1 24.38,25.15 24.89,25.65 v24.93,25.66 | 25.58,24.97 U1.C1 | 26.85,24.97 U1.B1 | 25.7,24.97 U1.C1 | 28.12,24.97 U1.A1 27.94,24.89 27.69,24.64 v27.53,24.51 | 26.98,24.97 U1.B1 | 25.7,26.24 U1.C2 25.4,26.42 25.15,26.67 25.15,26.92 v24.93,26.96 24.89,26.92 24.38,26.42 U1.D2 | 26.85,26.24 U1.B2 26.67,26.42 26.42,26.67 26.42,26.92 v26.23,26.96 | 28.25,27.51 U1.A3 | 23.16,27.51 U1.E3 23.11,27.69 23.62,28.19 | 24.31,27.51 U1.D3 | 25.58,27.51 U1.C3 | 24.43,27.51 U1.D3 | 26.85,27.51 U1.B3 | 25.7,27.51 U1.C3 | 28.12,27.51 U1.A3 | 26.98,27.51 U1.B3 | 23.16,37.67 U1.E11 23.11,37.85 23.62,38.35 v23.68,38.36 23.88,38.35 23.88,38.1 24.13,37.85 U1.D11 | 24.31,37.67 U1.D11 | 26.59,36.4 26.85,36.4 | 26.85,36.4 U1.B10 26.92,36.58 | 26.59,37.67 U1.B11 | 26.59,38.94 26.85,38.94 | 26.85,38.94 U1.B12 26.92,38.86 | 26.59,37.8 U1.B11 | 24.43,37.67 U1.D11 | 25.58,37.67 U1.C11 25.4,37.85 25.15,38.1 25.15,38.35 v24.98,38.36 | 24.43,31.32 U1.D6 | 23.16,31.32 U1.E6 | 24.31,31.32 U1.D6 | 25.58,31.32 U1.C6 25.4,31.24 25.15,30.99 25.15,30.73 | 24.43,38.94 U1.D12 | 24.31,38.94 U1.D12 | 25.58,38.94 U1.C12 25.4,39.12 25.15,39.37 25.15,39.62 v24.93,39.56 | 23.16,36.4 U1.E10 23.11,36.58 23.62,37.08 v23.68,37.11 23.88,37.08 23.88,36.83 24.13,36.58 U1.D10 | 24.31,36.4 U1.D10 | 25.58,36.4 U1.C10 25.4,36.58 25.15,36.83 25.15,37.08 v24.93,37.11 | 24.43,36.4 U1.D10 | 23.16,35.13 U1.E9 23.11,35.31 23.62,35.81 v23.68,35.86 23.88,35.81 23.88,35.56 24.13,35.31 U1.D9
  Top 0.152: 24.31,35.13 U1.D9 | 25.58,35.13 U1.C9 | 24.43,35.13 U1.D9 | 23.16,33.86 U1.E8 23.11,34.04 23.62,34.54 v23.68,34.56 23.88,34.54 23.88,34.29 24.13,34.04 U1.D8 | 24.31,33.86 U1.D8 | 25.58,33.86 U1.C8 25.4,34.04 25.15,34.29 25.15,34.54 v24.98,34.61 25.15,34.8 25.4,35.05 U1.C9 | 24.43,33.86 U1.D8 | 23.16,32.59 U1.E7 | 24.31,32.59 U1.D7 24.13,32.77 23.88,33.02 23.88,33.27 v23.68,33.36 23.62,33.27 23.11,32.77 U1.E7 | 23.16,30.05 U1.E5 23.11,29.97 23.62,29.46 v23.68,29.51 23.88,29.46 | 24.31,30.05 U1.D5 24.13,29.97 23.88,29.72 23.88,29.46 | 23.16,32.72 U1.E7 | 25.45,32.72 U1.C7 25.4,32.77 25.15,33.02 25.15,33.27 v24.98,33.31 | 25.45,35 U1.C9 | 24.43,36.52 U1.D10 | 23.93,40.84 R3.2 | SJ4.2 43.43,34.54 43.69,34.29 43.69,24.13 J5.4 43.94,23.88 44.7,23.11 44.7,16.51 v44.2,16 44.2,13.46 J4.4 | v28.19,14.99 29.46,16.26 29.46,17.02 C4.2 29.72,17.27 29.72,20.57 C3.2 29.72,20.83 32.51,23.62 32.51,24.13 37.59,24.13 J5.1 37.85,23.88 38.86,22.86 38.86,14.22 38.1,13.46 J4.1 | v60.96,2.29 60.96,3.3 J3.1 | v5.08,5.08 5.08,4.32 13.97,4.32 C5.K1 | v52.32,35.56 53.59,35.56 R36.2 | 23.37,40.39 23.88,40.89 R3.2 | 26.92,37.59 U1.B11 | 26.92,37.85 U1.B11 | 23.62,28.19 23.11,28.7 U1.E4 | 23.62,28.19 v23.63,28.21 23.88,28.19 23.88,27.94 24.13,27.69 U1.D3 | 23.88,29.46 23.88,29.21 24.13,28.96 U1.D4 | U1.C1 25.4,24.89 25.15,24.64 v24.98,24.46 | 25.15,28.19 25.15,27.94 25.4,27.69 U1.C3 | 25.15,28.19 25.15,28.45 25.4,28.7 U1.C4 | 25.15,28.19 v24.93,28.21 | 25.15,30.73 25.15,30.48 25.4,30.23 U1.C5 | U1.B1 26.67,24.89 26.42,24.64 v26.23,24.51 | U1.A2 28.19,26.42 28.45,26.67 28.45,26.92 v28.63,27.01 28.45,27.18 28.19,27.43 U1.A3
  Top 0.152: 23.62,39.62 23.11,39.12 U1.E12 | U1.B3 26.67,27.69 26.42,27.94 26.42,28.19 v26.23,28.21 | v26.23,29.46 26.42,29.46 26.42,29.21 26.67,28.96 U1.B4 26.92,28.96 27.94,29.97 U1.A5 | U1.D6 24.38,31.24 24.89,30.73 v24.93,30.76 25.15,30.73 | U1.D12 24.13,39.12 23.88,39.37 23.88,39.62 v23.68,39.56 23.62,39.62 | U1.A12 28.19,38.86 28.45,38.61 v28.58,38.41 | 23.37,40.39 23.62,40.13 23.62,39.62 | 23.37,40.39 R3.2 | U1.A7 28.19,32.77 28.96,32.77 v29.01,32.72
  Bottom 0.152: R29.1 27.43,21.34 24.89,21.34 R30.1 24.64,21.34 23.11,21.34 | R24.1 17.27,21.34 19.3,21.34 R26.1 19.56,21.08 v20.83,21.08 21.84,21.08 R28.1 22.1,21.34 23.11,21.34 | 15.24,18.03 15.24,18.54 14.22,18.54 U4.10 | 15.24,18.03 15.24,16.76 | 15.24,16.76 15.24,15.49 16.76,13.97 U3.1 | 15.24,16.76 4.57,16.76 2.79,18.54 U4.1 | 15.24,18.03 17.02,18.03 R23.1 17.27,18.03 19.3,18.03 R25.1 19.56,18.03 22.35,18.03 R27.1 22.61,18.03 23.11,18.03 23.11,21.34 | v28.19,14.99 28.19,13.97 U3.10
  other vias: 28.63,25.61 27.48,25.66 26.23,25.66 24.93,35.86 85.09,5.08 8.89,90.81 82.55,90.81 27.48,26.97
  pour GND_PLANE (no thermals): 3.4,1.45 34.2,1.45 37.15,4.4 58.2,4.4 58.35,4.25 58.35,1.95 58.6,1.7 87,1.7 88.65,3.35 88.65,57.65 88.6,57.7 88.6,91.1 85.53,94.25 60.47,94.22 57.94,91.75 56.49,91.7 35.79,91.85 33.56,94.02 32,94.05 3.95,94.05 1.43,91.48 1.4,89.65 1.45,89.6 1.45,58.5 3.05,56.9 3.08,38.41 1.75,37.13 1.75,36.75 1.7,36.6 1.7,3.15
  pour Top (no thermals): 28.73,28.12 32.74,28.12 42.14,37.52 54.15,37.52 55.42,36.25 55.42,17.7 57.4,15.72 80.01,15.72 81.53,14.2 81.53,3.43 80.21,2.11 59.28,2.11 58.06,3.33 58.06,4.01 57.33,4.75 36.4,4.75 33.17,1.52 3.63,1.52 1.7,3.45 1.7,6.96 2.95,8.53 6.43,8.53 8.51,6.6 14.86,6.5 14.88,6.48 15.04,6.48 15.82,5.69 32.36,5.69 33.53,6.86 33.53,8.56 32.13,9.96 32.13,10.87 32.51,11.25 32.51,14.71 31.95,15.27 31.47,15.27 30.71,16.03 30.71,22.2 30.33,22.58 27.99,22.58 27.25,23.32 25.3,23.32 25.3,23.39 24,24.69 24,27.1 22.66,27.08 22.61,39.78 28.91,39.78 28.91,37.06 27.41,37.06 27.41,35.92 26.19,35.92 26.19,29.36 27.46,29.36 27.46,29.34 27.48,29.34 27.48,28.17 28.68,28.17 28.68,28.14
  pour Bottom (no thermals): 3.4,1.45 34.2,1.45 37.15,4.4 58.2,4.4 58.35,4.25 58.35,1.95 58.6,1.7 87,1.7 88.65,3.35 88.65,57.65 88.6,57.7 88.6,91.1 85.53,94.25 60.47,94.22 57.94,91.75 56.49,91.7 35.79,91.85 33.56,94.02 32,94.05 3.95,94.05 1.43,91.48 1.4,89.65 1.45,89.6 1.45,58.5 3.05,56.9 3.08,38.41 1.75,37.13 1.75,36.75 1.7,36.6 1.7,3.15
RSENSE  (via drill 0.1, 0.1 pad 0.25)
  Top 0.152: 20.62,32.59 U1.G7 | U1.J7 18.09,32.72 18.09,32.84 U1.J7 | 19.23,32.84 U1.H7 19.1,32.46 | 15.54,31.19 U1.L6 15.24,31.24 | 16.82,31.19 U1.K6 16.51,31.24 | 18.09,30.18 U1.J5 17.78,30.23 | 19.36,30.18 U1.H5 19.05,30.23 | 18.09,32.46 U1.J7 | 19.36,33.98 U1.H8 19.3,34.04 | 19.36,35.26 U1.H9 19.3,35.31 | 20.37,32.72 U1.G7 | 19.36,36.52 U1.H10 19.3,36.58 | 21.64,36.52 U1.F10 21.59,36.58 | 21.64,37.8 U1.F11 21.59,37.85 | 21.64,39.06 U1.F12 21.59,39.12 | 21.13,40.84 R3.1 21.08,40.89 | 13.97,30.23 U1.M5 | 15.24,30.23 U1.L5 | 16.51,30.23 U1.K5 | 20.57,30.23 U1.G5 | 13.97,31.24 U1.M6 | 17.78,31.24 U1.J6 | 20.57,31.24 U1.G6 | 18.03,32.51 U1.J7 | 20.57,32.51 U1.G7 | 20.83,33.53 20.57,33.78 U1.G8 | 20.57,35.05 U1.G9 | 20.32,36.58 U1.G10 | 19.3,37.85 U1.H11 | 20.32,37.85 U1.G11 | 19.3,39.12 U1.H12 | 20.32,39.12 U1.G12 | v29.01,28.65 28.96,28.7 28.19,28.7 U1.A4
  GND_PLANE/TRACE 0.152: v29.01,28.65 26.16,31.5 20.98,31.5
  other vias: 13.51,30.73 14.81,30.73 16.06,30.73 17.33,30.73 18.63,32.01 18.63,32.01 18.56,30.71 19.88,30.71 19.88,32.01 19.88,33.26 19.88,33.26 19.88,34.56 19.86,35.81 20.78,34.56 21.08,35.86 21.13,37.08 19.88,37.08 21.13,38.36 19.86,38.36 19.88,39.66 21.13,39.66 20.78,33.29 20.83,32.04 20.8,30.72
  pour Bottom (isolate 0.25, no thermals): 13.63,31.86 17.56,31.86 17.56,33.13 18.96,33.16 18.99,44.24 22,44.27 22.18,35.93 20.98,35.91 20.98,29.63 13.63,29.63
  pour Top (isolate 0.25, no thermals): 13.63,31.86 17.56,31.86 17.56,33.13 18.96,33.16 18.99,44.24 22,44.27 22.18,35.93 20.98,35.91 20.98,29.63 13.63,29.63
  pour GND_PLANE/TRACE (isolate 0.25, no thermals): 13.63,31.86 17.56,31.86 17.56,33.13 18.96,33.16 18.99,44.24 22,44.27 22.18,35.93 20.98,35.91 20.98,29.63 13.63,29.63
SETFREQ
  Top 0.152: 31.5,37.08 31.5,40.64 30.48,41.66 R1.2 | 31.5,37.08 31.5,34.54 27.43,34.54 26.92,34.04 U1.B8 | 31.5,37.08 36.58,37.08 R2.1
SGND  (via drill 0.1)
  Top 0.152: v58.67,38.86 v58.67,32.26 | 48.26,10.67 48.26,8.64 J4.12 48.26,8.38 v55.88,8.38 | 48.26,10.67 48.26,10.92 49.02,11.68 49.02,18.03 48.01,19.05 J5.12 | 42.93,10.67 42.93,15.49 41.91,16.51 41.91,19.05 J5.9 41.91,19.3 42.67,20.07 42.67,27.18 40.13,29.72 SJ3.2 39.88,29.72 38.86,30.73 38.86,33.02 37.59,34.29 | 42.93,10.67 42.93,9.4 42.16,8.64 J4.9 | 42.93,10.67 48.26,10.67 | 37.59,34.29 36.83,35.05 R2.2 | 37.59,34.29 39.37,36.07 v39.37,36.32
  Bottom 0.152: v58.67,32.26 61.98,32.26 63.75,30.48 OK1.15 | v58.67,38.86 58.67,40.39 57.66,40.39 OK2.8 57.4,40.64 56.13,41.91 53.85,41.91 52.58,40.64 OK2.6 52.32,40.39 50.8,38.86 49.02,38.86 47.5,40.39 OK2.4 47.24,40.39 45.72,38.86 43.94,38.86 42.93,39.88 | 64.26,9.65 61.98,9.65 60.71,8.38 OK3.8 60.45,8.38 v55.88,8.38 | 64.26,9.65 65.53,8.38 OK3.6 | 69.34,9.65 70.61,8.38 OK3.4 | 64.26,9.65 69.34,9.65 | 69.34,9.65 74.42,9.65 75.69,8.38 OK3.2 | 42.93,39.88 42.42,40.39 OK2.2 42.93,39.88 | 42.93,39.88 v39.37,36.32
  pour GND_PLANE/TRACE (no thermals): 28.7,28.14 32.72,28.14 42.11,37.54 54.13,37.54 55.4,36.27 55.4,17.73 57.38,15.75 65.25,15.67 64.74,16.18 64.74,42.7 63.98,43.46 31.34,43.46 30.91,43.03 22.99,43.03 22.94,43.08 22.94,43.97 21.62,45.29 21.29,45.29 21.56,45.57 21.56,47.37 19.99,48.95 3.33,48.95 3.61,49.23 3.61,56.77 1.91,58.47 1.91,85.93 3.07,87.1 10.13,87.1 11.94,88.9 12.14,88.9 12.34,89.1 12.34,92.79 13.26,93.7 13.26,93.75 13.36,93.85 33.55,93.85 35.71,91.69 58.22,91.69 60.55,94.03 60.58,94.03 60.63,94.08 77.8,93.95 78.03,93.95 78.84,92.63 78.84,87.66 81.25,86.92 86.28,86.92 87.3,86.18 87.17,12.45 84.76,10.03 84.56,10.03 81.51,6.99 81.51,3.45 80.19,2.13 59.26,2.13 58.04,3.35 58.04,4.04 57.3,4.78 36.37,4.78 33.15,1.55 3.61,1.55 1.68,3.48 1.68,6.99 2.92,8.56 6.4,8.56 8.48,6.63 14.83,6.53 14.86,6.5 15.01,6.5 15.8,5.71 32.33,5.71 33.5,6.88 33.5,8.59 32.11,9.98 32.11,10.9 32.51,11.3 32.49,14.73 31.93,15.29 31.45,15.29 30.68,16.05 30.68,22.23 30.3,22.61 27.97,22.61 27.23,23.34 25.27,23.34 25.27,23.42 23.98,24.71 23.98,26.95 24,26.97 23.98,26.97 23.88,27.08 22.61,27.05 22.58,39.8 28.88,39.8 28.88,37.08 27.38,37.08 27.38,35.94 26.16,35.94 26.16,29.39 27.43,29.39 27.43,29.36 27.46,29.36 27.46,28.19 28.65,28.19 28.65,28.17
SW1  (via drill 0.1 pad 0.25)
  Top 0.152: 16.82,28.78 U1.SW1@K4 | 15.54,28.78 U1.SW1@L4 15.42,28.78 | 14.28,28.78 U1.SW1@M4 14.22,28.7 | 16.69,28.78 U1.SW1@K4 | 16.82,27.51 U1.SW1@K3 16.51,27.69 | 15.54,27.51 U1.SW1@L3 | 14.28,27.51 U1.SW1@M3 14.22,27.69 | 16.82,24.97 U1.SW1@K1 | 17.96,24.97 U1.SW1@J1 | 14.28,24.97 U1.SW1@M1 13.97,25.15 | 15.54,24.97 U1.SW1@L1 | 15.42,24.97 U1.SW1@L1 | 16.69,24.97 U1.SW1@K1 | 16.82,26.24 U1.SW1@K2 16.69,26.24 | 17.96,26.24 U1.SW1@J2 | 15.54,26.24 U1.SW1@L2 | 14.28,26.24 U1.SW1@M2 14.02,26.11 | 15.42,26.24 U1.SW1@L2 | 15.29,26.36 U1.SW1@L2 | 6.4,26.11 6.4,25.86 L2.2 8.13,25.4 8.13,25.15 | 15.24,24.89 U1.SW1@L1 | 16.51,24.89 U1.SW1@K1 | 16.51,28.7 U1.SW1@K4 | 17.78,24.89 U1.SW1@J1 | 17.78,25.15 U1.SW1@J1
  other vias: 14.78,28.21 16.03,28.21 17.33,28.21 17.33,26.96 17.33,25.66 16.03,25.71 14.83,25.66 14.83,26.96 16.08,26.96 14.78,24.51 14.78,24.51 16.08,24.46 17.38,24.46 13.69,28.21 13.74,25.66 13.74,26.96 13.69,24.51 13.69,24.51 5.64,24.74 6.25,24.18 6.99,24.2 7.7,24.2 8.41,24.2 9.17,24.2 9.91,24.08 10.29,24.66 10.26,25.4 10.21,26.13 10.01,26.97 9.27,27 8.56,27 7.82,27 5.61,25.47 5.61,26.21 5.59,26.92 6.35,26.97 7.09,27
  pour Bottom (no thermals): 18.47,29.24 13.08,29.18 13,31.83 1.91,31.83 1.91,21.84 18.49,21.79 18.52,24.41 18.52,29.24
  pour GND_PLANE/TRACE (isolate 0.127, no thermals): 18.47,29.24 13.08,29.18 13,31.83 1.91,31.83 1.91,21.84 18.49,21.79 18.52,24.41 18.52,29.24
  pour Top (no thermals): 18.49,29.24 13.11,29.18 13.03,31.83 1.93,31.83 1.93,21.84 18.52,21.79 18.54,24.41 18.54,29.24
SW2  (via drill 0.1 pad 0.25)
  Top 0.152: 16.82,35.13 U1.K9 | 17.96,35.13 U1.J9 | 14.28,35.13 U1.M9 14.02,35.26 | 15.42,35.13 U1.L9 | 14.28,32.59 U1.M7 | 15.42,32.59 U1.L7 15.54,32.59 | 16.69,32.59 U1.K7 16.56,32.72 | 14.28,33.86 U1.M8 | 15.54,33.86 U1.L8 15.42,33.86 | 16.69,33.86 U1.K8 | 17.96,33.86 U1.J8 | 16.82,33.86 U1.K8 | 16.56,33.98 U1.K8 | 6.4,35.26 L2.1
  other vias: 14.78,34.56 16.08,34.56 17.33,34.56 16.08,33.31 14.78,33.31 6.2,33.74 7.06,33.71 7.8,33.74 8.53,33.74 9.25,33.74 9.96,33.79 10.19,34.55 10.21,35.29 10.21,36 9.55,36.46 8.84,36.43 8.08,36.43 7.34,36.41 6.58,36.41 5.84,36.36 5.56,35.64 5.64,34.96 5.64,34.27
  pour Top (no thermals): 12.22,35.66 12.22,37.08 1.8,37.08 1.8,32.21 17.17,32.18 17.2,32.21 17.2,33.4 18.47,33.4 18.47,35.66
  pour GND_PLANE/TRACE (no thermals): 12.22,35.66 12.22,37.08 1.8,37.08 1.8,32.21 17.17,32.18 17.2,32.21 17.2,33.4 18.47,33.4 18.47,35.66
  pour Bottom (no thermals): 12.22,35.66 12.22,37.08 1.8,37.08 1.8,32.21 17.17,32.18 17.2,32.21 17.2,33.4 18.47,33.4 18.47,35.66
SW_P18H1  (via drill 0.1)
  Top 0.152: v69.85,48.26 72.14,50.55 v72.14,57.91
  Bottom 0.152: v69.85,48.26 52.58,48.26 47.75,43.43 R11.2 | v72.14,57.91 74.93,57.91 U2.35
SW_P18H2  (via drill 0.1)
  Top 0.152: v60.71,44.96 64.26,48.51 v64.26,57.4
  Bottom 0.152: v60.71,44.96 60.2,44.96 58.93,43.69 R12.2 | v64.26,57.4 65.28,58.42 66.8,58.42 U2.34
SW_P18H3  (via drill 0.1)
  Top 0.152: v75.69,20.07 76.2,20.57 v76.2,50.55
  Bottom 0.152: v75.69,20.07 69.34,20.07 68.33,21.08 R13.2 | v76.2,50.55 76.71,51.05 76.71,58.67 75.18,58.67 U2.33
SW_P18H4
  Bottom 0.152: R14.2 79.76,21.59 79.76,24.13 80.77,25.15 80.77,66.04 74.17,66.04 68.33,60.2 68.33,59.18 67.06,59.18 U2.32
SW_P18L1  (via drill 0.1)
  Bottom 0.152: R7.2 39.37,43.69 v40.64,43.69 40.64,49.02 69.85,49.02 69.85,52.32 73.91,56.39 74.93,56.39 U2.39
SW_P18L2  (via drill 0.1)
  Top 0.152: v53.59,44.96 56.13,47.5 v56.13,54.1
  Bottom 0.152: v53.59,44.96 53.59,43.69 R8.2 | v56.13,54.1 58.67,56.64 66.8,56.64 U2.38
SW_P18L3  (via drill 0.1)
  Top 0.152: v60.45,22.86 59.94,23.37 v59.94,50.04
  Bottom 0.152: v60.45,22.86 60.71,22.86 62.23,21.34 R9.2 | v59.94,50.04 60.45,50.55 68.07,50.55 69.34,51.82 69.34,57.15 74.93,57.15 U2.37
SW_P18L4  (via drill 0.1)
  Top 0.152: v72.64,22.1 72.39,22.35 v72.39,43.18
  GND_PLANE/TRACE 0.152: v72.39,43.18 65.28,50.29 v65.28,57.4
  Bottom 0.152: v72.64,22.1 71.88,22.1 71.37,21.59 R10.2 | v65.28,57.4 66.8,57.4 U2.36
SW_RUNPMA  (via drill 0.1)
  Top 0.152: v31.75,34.04 28.19,34.04 U1.A8
  Bottom 0.152: v31.75,34.04 32.51,34.8 70.61,34.8 75.18,39.37 75.18,46.74 76.2,46.74 77.22,47.75 77.22,62.74 75.18,62.74 U2.23
SW_TP1  (via drill 0.1)
  Top 0.152: v72.64,59.44 69.09,59.44 69.09,42.42 v69.34,42.16 70.61,40.89 70.61,11.18 J6.4
  Bottom 0.152: v72.64,59.44 74.93,59.44 U2.31 | v69.34,42.16 69.09,41.91 65.28,41.91 64.01,40.64 OK1.2
TP1_OUT  (via drill 0.1)
  Top 0.152: 37.08,29.72 38.61,29.72 38.61,29.21 41.66,26.16 | 41.66,26.16 41.91,25.91 41.91,24.13 J5.3 41.66,23.88 40.89,23.11 40.89,17.53 41.4,17.02 41.4,13.97 41.91,13.46 J4.3 | 50.55,26.92 48.01,24.38 48.01,24.13 J5.6 47.75,23.88 46.99,23.11 46.99,17.53 48.01,16.51 48.01,13.46 J4.6 | 50.55,26.92 v51.05,27.43 | v66.04,26.92 68.07,24.89 68.07,8.64 66.04,8.64 J3.8 | v41.91,26.16 41.66,26.16 | R35.2 49.78,35.56 51.56,35.56 53.09,34.04 53.59,34.04 R36.1 53.59,33.78 50.55,30.73 50.55,26.92
  Bottom 0.152: 59.69,28.7 58.42,27.43 v51.05,27.43 43.18,27.43 v41.91,26.16 | 59.69,28.7 61.21,30.23 OK1.16 | v66.04,26.92 64.26,28.7 59.69,28.7
UART0_RX  (via drill 0.1)
  Top 0.152: 62.74,62.48 61.72,62.48 44.2,80.01 9.91,80.01 J2.6 | 62.74,62.48 v65.28,62.48 | J6.3 75.69,8.64 75.69,19.3 74.17,20.83 v74.17,42.16 | v60.71,45.72 60.71,59.69 62.74,61.72 62.74,62.48
  Bottom 0.152: v65.28,62.48 66.8,62.48 U2.24 | v74.17,42.16 70.61,45.72 v60.71,45.72
UART0_TX  (via drill 0.1)
  Top 0.152: v61.98,61.72 51.31,61.72 33.78,79.25 5.08,79.25 5.08,80.01 J2.3 | J6.2 76.45,6.1 76.45,20.32 77.22,21.08 77.22,60.96 v71.88,66.29
  Bottom 0.152: v61.98,61.72 66.8,61.72 U2.26 67.06,61.72 68.33,61.72 68.33,62.74 v71.88,66.29
VBATT_IN
  Top 0.889: 10.16,55.88 SJ1.2 | 7.62,58.42 C1.A1 | SJ1.2 9.91,55.63 8.13,53.85 8.13,53.59 L1.1 | SJ1.2 9.91,56.13 7.87,58.17 C1.A1 | 12.19,63.5 12.19,77.98 9.91,77.98 J2.5 | 12.19,63.5 7.62,58.93 C1.A1 | J3.3 60.71,8.64 57.66,8.64 57.66,54.1 48.51,63.25 12.45,63.25 12.19,63.5
VFB
  Top 0.152: U1.B6 26.92,31.24 27.43,30.73 30.23,30.73 30.23,30.99 R4.2
VIN  (via drill 0.1 pad 0.25)
  Top 0.152: 14.28,38.94 U1.M12 | 15.42,38.94 U1.L12 15.54,38.94 | 16.69,38.94 U1.K12 | 16.82,38.94 U1.K12 | 14.28,36.4 U1.M10 | 15.42,36.4 U1.L10 15.54,36.4 | 16.69,36.4 U1.K10 16.82,36.4 | 17.96,36.4 U1.J10 17.96,36.52 | 14.28,37.67 U1.M11 14.15,37.67 13.64,37.16 v13.48,37.11 | 15.42,37.67 U1.L11 15.54,37.67 | 16.69,37.67 U1.K11 16.82,37.67 | 17.96,37.67 U1.J11 17.96,37.8 | 17.96,38.94 U1.J12 | 16.69,39.06 U1.K12 | 14.91,37.16 v14.78,37.11 | 16.05,39.45 v16.03,39.56 | 17.45,37.16 v17.33,37.08 | 16.18,37.16 v16.06,37.08 | 16.18,38.43 v16.06,38.36 | 17.45,38.43 v17.33,38.36
  other vias: 14.78,38.36 14.78,39.51 13.48,38.38 6.32,42.52 7.05,42.52 7.79,42.49 8.5,42.52 9.19,42.49 9.87,42.52 10.13,43.23 5.66,43.05 10.15,43.96 10.2,44.62 9.93,45.34 9.14,45.36 8.43,45.36 7.72,45.36 6.98,45.36 6.22,45.41 5.58,44.95 5.58,44.22
  pour Bottom (no thermals): 18.49,35.94 12.5,35.94 12.5,37.36 3.05,37.34 3.05,47.8 18.49,47.85
  pour GND_PLANE/TRACE (no thermals): 18.49,35.94 12.5,35.94 12.5,37.36 3.05,37.34 3.05,47.8 18.49,47.85
  pour Top (no thermals): 18.52,35.92 12.52,35.92 12.52,37.34 3.05,37.34 3.05,47.8 18.52,47.83
VOUT  (via drill 0.1, 0.1 pad 0.25)
  Top 0.406: C4.1 26.67,17.27 26.67,20.57 C3.1 | 22.86,26.42 U1.E2 | 21.84,26.42 U1.F2 | 21.84,28.96 U1.F4 | 20.57,28.96 U1.G4
  GND_PLANE 0.254: v22.23,24.56 22.25,24.56 22.28,24.54 22.28,24.18 23.72,23.14 23.75,23.11 v23.75,22.7
  other vias: 19.88,24.41 21.13,25.66 19.88,25.66 19.88,26.96 21.13,26.96 19.88,28.26 21.13,28.21 25.43,16.08 25.43,16.92 25.4,17.78 25.37,18.57 25.37,22.23 25.96,22.58 26.85,22.58
  pour Top (no thermals): 27.71,15.57 25.32,15.57 18.97,22.02 18.97,29.16 22.23,29.16 22.23,26.75 23.5,26.75 23.5,26.7 23.52,26.7 23.52,24.49 23.52,24.46 25.1,22.89 27.13,22.89 27.84,22.17 27.84,15.7
  pour GND_PLANE/TRACE (no thermals): 27.71,15.57 25.32,15.57 18.97,21.46 18.97,29.16 22.23,29.16 22.23,26.75 23.5,26.75 23.5,26.7 23.52,26.7 23.52,24.46 25.1,22.89 27.13,22.89 27.84,22.17 27.84,15.7
  pour Bottom (no thermals): 18.9,24.1 23.44,24.16 23.44,26.7 22.2,26.64 22.2,29.16 18.87,29.16
VOUTA  (via drill 0.1)
  Top 0.406: v4.06,10.41 v7.37,10.41 13.97,10.41 13.97,12.7 C5.A1 14.22,12.95 20.83,12.95 Q3.D | v28.19,6.1 27.94,6.35 27.94,7.62 R31.2 27.69,7.87 27.69,9.14 R32.2 27.69,9.4 27.69,12.95 Q7.D | Q7.D 27.94,13.21 30.73,13.21 Q5.D 30.99,13.21 v35.05,17.27 | 24.26,9.53 24.38,9.65 24.38,12.95 Q1.D | 24.26,9.53 23.88,9.14 R34.2 | 24.26,9.53 25.15,8.64 25.15,8.38 25.65,7.87 R33.2 | Q3.D 21.08,13.21 24.38,13.21 Q1.D | L3.2 20.07,17.27 20.83,16.51 20.83,13.21 Q3.D | Q7.D 27.69,13.21 24.64,13.21 Q1.D | v56.64,25.91 v56.64,19.3 56.64,4.83 62.48,4.83 62.99,4.32 62.99,3.56 65.79,3.56 J3.6 | v49.53,26.67 49.53,33.53 49.78,33.78 R35.1
  Bottom 0.406: 8.51,10.29 8.89,9.91 8.89,9.4 U4.15 | 8.51,10.29 8.38,10.41 v7.37,10.41 7.11,10.16 6.6,10.16 6.6,9.4 U4.17 | 11.43,10.41 11.43,9.4 U4.13 | 11.43,10.41 8.64,10.41 8.51,10.29 | 11.43,10.41 13.97,10.41 13.97,9.4 U4.11 14.22,9.14 14.22,7.62 16.26,7.62 18.29,5.59 | U3.20 17.02,4.57 18.03,4.57 U3.19 18.29,4.57 18.29,5.59 | 20.83,5.59 20.83,4.57 U3.17 | 20.83,5.59 22.35,5.59 22.48,5.46 | 22.48,5.46 23.37,4.57 U3.15 | U3.13 25.65,4.57 25.65,5.59 22.61,5.59 22.48,5.46 | 20.83,5.59 18.29,5.59 | U4.20 2.79,9.4 3.81,9.4 U4.19 4.06,9.4 v4.06,10.41 | v28.19,6.1 28.19,4.57 U3.11 | R22.1 78.99,26.16 76.2,26.16 R18.1 75.95,26.16 72.64,26.16 R20.1 72.39,26.16 69.09,26.16 R21.1 68.83,25.91 66.04,25.91 R16.1 65.79,25.91 62.48,25.91 R15.1 62.23,25.91 59.44,25.91 R17.1 59.18,25.91 v56.64,25.91 50.29,25.91 v49.53,26.67 | R19.1 58.17,19.05 57.91,19.3 v56.64,19.3 55.88,18.54 36.32,18.54 v35.05,17.27
  pour Top (no thermals): 2.03,16.05 15.77,16.05 19.74,20.02 19.99,20.02 25.27,14.73 31.95,14.73 32.61,14.07 32.61,11.89 31.67,10.95 31.67,9.75 32.89,8.53 32.89,6.88 32.21,6.2 16,6.2 14.94,7.26 9.86,7.26 8.53,7.29 6.73,9.02 2.62,9.07 2.03,9.65
  pour GND_PLANE/TRACE (no thermals): 2.03,16.05 15.77,16.05 19.74,20.02 19.99,20.02 25.27,14.73 31.95,14.73 32.03,14.02 32.13,11.53 31.67,10.95 31.67,9.75 32.89,8.53 32.89,6.88 32.21,6.2 16,6.2 14.94,7.26 9.83,7.26 9.58,7.52 8.08,7.49 6.1,9.07 2.62,9.07 2.03,9.65
  pour Bottom (no thermals): 2.03,16.05 15.77,16.05 19.74,20.02 19.99,20.02 25.27,14.73 31.95,14.73 32.61,14.07 32.61,11.89 31.67,10.95 31.67,9.75 32.89,8.53 32.89,6.88 32.21,6.2 16,6.2 14.94,7.26 9.83,7.26 9.58,7.52 8.05,7.49 6.58,9.09 2.62,9.07 2.03,9.65

## Text on the board
GND_PLANE/TRACE: Second star to the right and straight on 'til morning!
Document: MCAT-4CU-B Controller (Ver. 2F) / 13MAY14 GWU Micro-propulsion and Nanotechnology Lab / (c) George Washington University, 2014